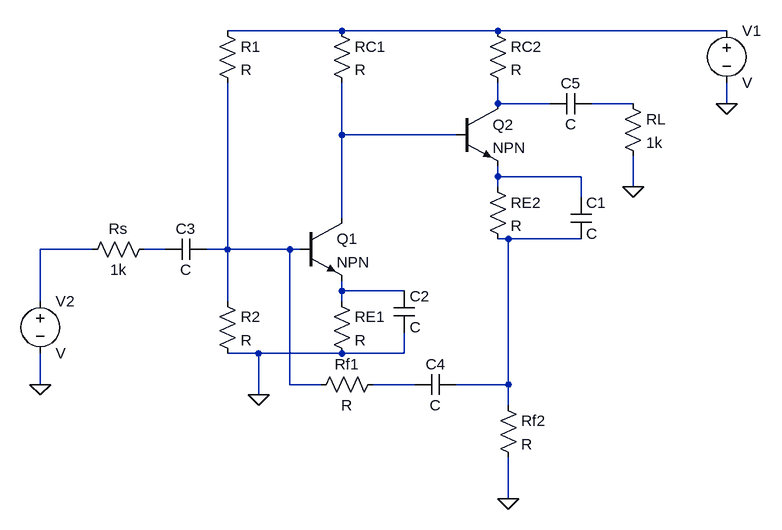
[diagram p0: schematic Simulacion TP2 Aplicada.asc]
Simulacion TP2 Aplicada.asc, the LTspice schematic file:
Version 4
SHEET 1 880 680
WIRE 112 -144 -64 -144
WIRE 352 -144 112 -144
WIRE 704 -144 352 -144
WIRE 352 -32 352 -64
WIRE 432 -32 352 -32
WIRE 560 -32 496 -32
WIRE 704 -32 704 -64
WIRE 112 16 112 -64
WIRE 288 16 112 16
WIRE 352 80 352 64
WIRE 480 80 352 80
WIRE 352 96 352 80
WIRE 560 96 560 48
WIRE 480 112 480 80
WIRE 112 144 112 16
WIRE 368 176 352 176
WIRE 480 176 368 176
WIRE -272 192 -352 192
WIRE -160 192 -192 192
WIRE -64 192 -64 -64
WIRE -64 192 -96 192
WIRE 32 192 -64 192
WIRE 48 192 32 192
WIRE 112 256 112 240
WIRE 208 256 112 256
WIRE -352 272 -352 192
WIRE -64 272 -64 192
WIRE 112 272 112 256
WIRE -16 352 -64 352
WIRE 112 352 -16 352
WIRE 208 352 208 320
WIRE 208 352 112 352
WIRE -352 400 -352 352
WIRE 32 400 32 192
WIRE 80 400 32 400
WIRE 224 400 160 400
WIRE 368 400 368 176
WIRE 368 400 288 400
WIRE -16 416 -16 352
WIRE 368 432 368 400
WIRE 368 576 368 512
FLAG -16 416 0
FLAG 368 576 0
FLAG 560 96 0
FLAG -352 400 0
FLAG 704 -32 0
SYMBOL npn 48 144 R0
SYMATTR InstName Q1
SYMBOL npn 288 -32 R0
SYMATTR InstName Q2
SYMBOL res 336 -160 R0
SYMATTR InstName RC2
SYMBOL res 336 80 R0
SYMATTR InstName RE2
SYMBOL res 96 256 R0
SYMATTR InstName RE1
SYMBOL res 352 416 R0
SYMATTR InstName Rf2
SYMBOL res 96 -160 R0
SYMATTR InstName RC1
SYMBOL res -80 -160 R0
SYMATTR InstName R1
SYMBOL res -80 256 R0
SYMATTR InstName R2
SYMBOL cap 464 112 R0
SYMATTR InstName C1
SYMBOL cap 192 256 R0
SYMATTR InstName C2
SYMBOL cap -96 176 R90
WINDOW 0 0 32 VBottom 2
WINDOW 3 32 32 VTop 2
SYMATTR InstName C3
SYMBOL res -176 176 R90
WINDOW 0 0 56 VBottom 2
WINDOW 3 32 56 VTop 2
SYMATTR InstName Rs
SYMATTR Value 1k
SYMBOL res 176 384 R90
WINDOW 0 0 56 VBottom 2
WINDOW 3 32 56 VTop 2
SYMATTR InstName Rf1
SYMBOL cap 288 384 R90
WINDOW 0 0 32 VBottom 2
WINDOW 3 32 32 VTop 2
SYMATTR InstName C4
SYMBOL cap 496 -48 R90
WINDOW 0 0 32 VBottom 2
WINDOW 3 32 32 VTop 2
SYMATTR InstName C5
SYMBOL res 544 -48 R0
SYMATTR InstName RL
SYMATTR Value 1k
SYMBOL voltage 704 -160 R0
SYMATTR InstName V1
SYMBOL voltage -352 256 R0
SYMATTR InstName V2

The netlist it stands for:
* Simulacion TP2 Aplicada.asc
Q1 N004 N009 N010 0 NPN
Q2 N002 N004 N005 0 NPN
RC2 N001 N002 R
RE2 N005 N006 R
RE1 N010 0 R
Rf2 N006 0 R
RC1 N001 N004 R
R1 N001 N009 R
R2 N009 0 R
C1 N005 N006 C
C2 N010 0 C
C3 N009 N008 C
Rs N008 N007 1k
Rf1 N011 N009 R
C4 N006 N011 C
C5 N003 N002 C
RL N003 0 1k
V1 N001 0 V
V2 N007 0 V
.model NPN NPN
.model PNP PNP
.lib standard.bjt
.backanno
.end